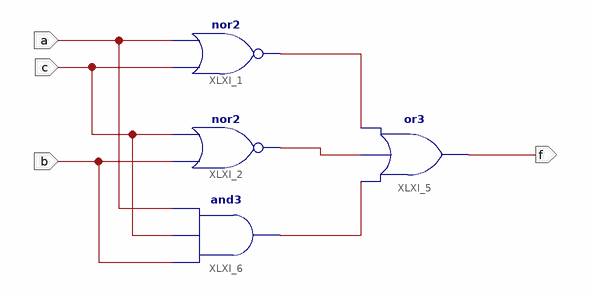
[diagram p0: schematic sheet 1]
// Xilinx ISE schematic pripr.sch (spartan3e) as structural Verilog: 4 symbols, 4 ports
module pripr (
  input  a,
  input  c,
  input  b,
  output f
);

  wire XLXN_8, XLXN_9, XLXN_10;

  nor XLXI_1 (XLXN_8, c, a);
  nor XLXI_2 (XLXN_9, b, c);
  or XLXI_5 (f, XLXN_10, XLXN_9, XLXN_8);
  and XLXI_6 (XLXN_10, b, c, a);
endmodule
